# Altium schematic sheet Box.SchDoc
size A
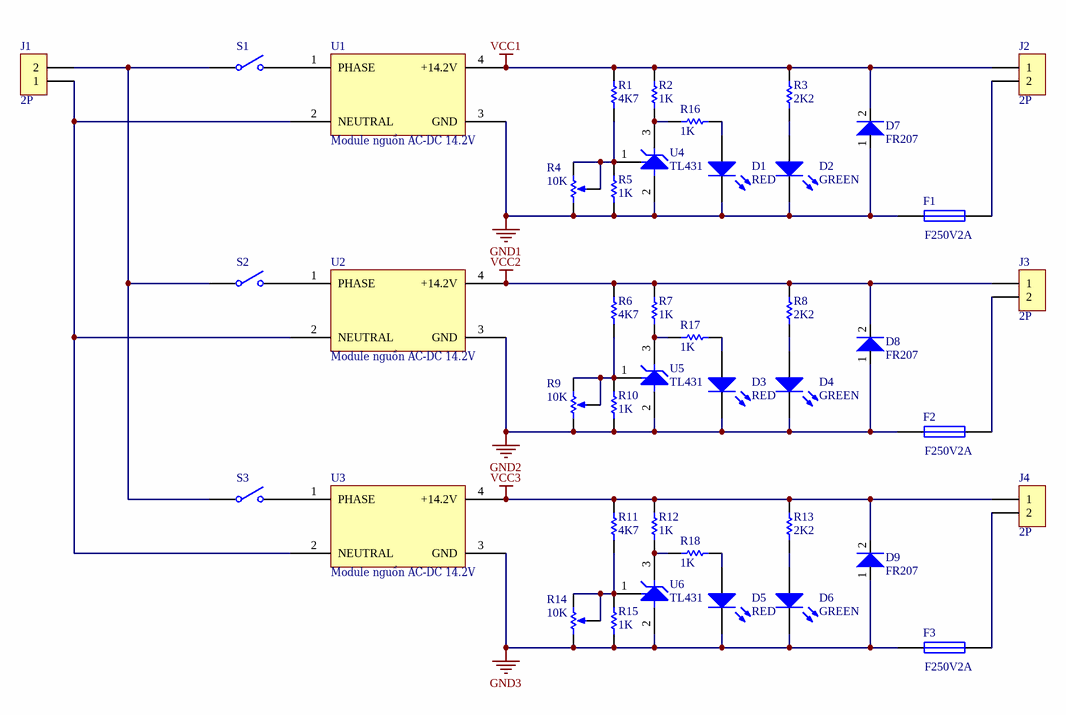
[diagram p0: Box.SchDoc]

## Parts
D1  value RED  [LED-0]
D2  value GREEN  [LED-0]
D3  value RED  [LED-0]
D4  value GREEN  [LED-0]
D5  value RED  [LED-0]
D6  value GREEN  [LED-0]
D7  value FR207  [DIODE1A]
D8  value FR207  [DIODE1A]
D9  value FR207  [DIODE1A]
F1  value F250V2A  [FUSE2]
F2  value F250V2A  [FUSE2]
F3  value F250V2A  [FUSE2]
J1  value 2P  [JACK2]  (hidden comment: Giắc xanh loại đứng, 300V/16A - 5.08mm 2P)
J2  value 2P  [JACK2]  (hidden comment: Giắc xanh loại đứng, 300V/16A - 5.08mm 2P)
J3  value 2P  [JACK2]  (hidden comment: Giắc xanh loại đứng, 300V/16A - 5.08mm 2P)
J4  value 2P  [JACK2]  (hidden comment: Giắc xanh loại đứng, 300V/16A - 5.08mm 2P)
R1  value 4K7  [0805DD]
R2  value 1K  [0805DD]
R3  value 2K2  [0805DD]
R4  value 10K  [BTXANH]
R5  value 1K  [0805DD]
R6  value 4K7  [0805DD]
R7  value 1K  [0805DD]
R8  value 2K2  [0805DD]
R9  value 10K  [BTXANH]
R10  value 1K  [0805DD]
R11  value 4K7  [0805DD]
R12  value 1K  [0805DD]
R13  value 2K2  [0805DD]
R14  value 10K  [BTXANH]
R15  value 1K  [0805DD]
R16  value 1K  [0805DD]
R17  value 1K  [0805DD]
R18  value 1K  [0805DD]
S1  Giắc cắm loại đứng, 300V/16A - 5.08mm 2P  [JACK2]  (value not drawn)
S2  Giắc cắm loại đứng, 300V/16A - 5.08mm 2P  [JACK2]  (value not drawn)
S3  Giắc cắm loại đứng, 300V/16A - 5.08mm 2P  [JACK2]  (value not drawn)
U1  Module nguồn AC-DC 14.2V  [PS15V2A]
U2  Module nguồn AC-DC 14.2V  [PS15V2A]
U3  Module nguồn AC-DC 14.2V  [PS15V2A]
U4  value TL431  [TO92_431]
U5  value TL431  [TO92_431]
U6  value TL431  [TO92_431]

## Nets
GND1: D1.2(K) D2.2(K) D7.1(A) F1.1 R4.1(TOP) R5.1 U1.3(GND) U4.2(A)
GND2: D3.2(K) D4.2(K) D8.1(A) F2.1 R9.1(TOP) R10.1 U2.3(GND) U5.2(A)
GND3: D5.2(K) D6.2(K) D9.1(A) F3.1 R14.1(TOP) R15.1 U3.3(GND) U6.2(A)
VCC1: D7.2(K) J2.1 R1.1 R2.2 R3.2 U1.4(+14.2V)
VCC2: D8.2(K) J3.1 R6.1 R7.2 R8.2 U2.4(+14.2V)
VCC3: D9.2(K) J4.1 R11.1 R12.2 R13.2 U3.4(+14.2V)
NetD1_1: D1.1(A) R16.1
NetD2_1: D2.1(A) R3.1
NetD3_1: D3.1(A) R17.1
NetD4_1: D4.1(A) R8.1
NetD5_1: D5.1(A) R18.1
NetD6_1: D6.1(A) R13.1
NetF1_2: F1.2 J2.2
NetF2_2: F2.2 J3.2
NetF3_2: F3.2 J4.2
NetJ1_1: J1.1 U1.2(NEUTRAL) U2.2(NEUTRAL) U3.2(NEUTRAL)
NetJ1_2: J1.2 S1.1(COMMON) S2.1(COMMON) S3.1(COMMON)
NetR1_2: R1.2 R4.2(TAP) R4.3(BOT) R5.2 U4.1(R)
NetR2_1: R2.1 R16.2 U4.3(K)
NetR6_2: R6.2 R9.2(TAP) R9.3(BOT) R10.2 U5.1(R)
NetR7_1: R7.1 R17.2 U5.3(K)
NetR11_2: R11.2 R14.2(TAP) R14.3(BOT) R15.2 U6.1(R)
NetR12_1: R12.1 R18.2 U6.3(K)
NetS1_2: S1.2(NO) U1.1(PHASE)
NetS2_2: S2.2(NO) U2.1(PHASE)
NetS3_2: S3.2(NO) U3.1(PHASE)

## Library data of the parts
D1-D6 = LED0: Typical INFRARED GaAs LED; Type1: LED dán 0805; Type2: LED chân cắm 3mm; Type3: LED chân cắm 5mm; Published: *; LatestRevisionDate: *; LatestRevisionNote: *; PackageReference: *; Publisher: *
D7-D9 = DIODE: Type1: Diode xung chân cắm 3A; Type2: Diode chỉnh lưu chân cắm 1A; Type3: Diode chỉnh lưu chân cắm 3A; Type4: Diode xung chân cắm 2A
F1-F3 = Fuse 1: Fuse; Type1: Cầu chì và đế cầu chì; Published: 8-Jun-2000; LatestRevisionDate: 17-Jul-2002; LatestRevisionNote: Re-released for DXP Platform.; PackageReference: PIN-W2/E2.8; Publisher: Altium Limited; PackageDescription: Thru-Hole; 2 Leads
J1-J4 = CON2: Type1: Giắc xanh loại nằm, 300V/16A - 5.08mm; Type2: Jump đực loại thẳng, 2.54mm; Type3: Jumper; Type4: Giắc xanh loại nằm, 300V/16A - 3.81mm
R1-R3 R5-R8 R10-R13 R15-R18 = Res Semi: Semiconductor Resistor; Type1: Điện trở dán 0805; Type2: Điện trở chân cắm 1/4W; Type3: Điện trở chân cắm 2W; Published: *; LatestRevisionDate: *; LatestRevisionNote: *; PackageReference: *; Publisher: *
R4 R9 R14 = RPot: Potentiometer; Type1: Biến trở vi chỉnh TRIMMER 3296; Published: *; LatestRevisionDate: *; LatestRevisionNote: *; PackageReference: *; Publisher: *; Sim Note: *; Set Position: *
S1-S3 = SW-SPST: Single-Pole, Single-Throw Switch; Published: 24-Mar-1999; LatestRevisionDate: 17-Jul-2002; LatestRevisionNote: Re-released for DXP Platform.; PackageReference: SPST-2; Publisher: Altium Limited; PackageDescription: Switch; 2 Leads
U1-U3 = SACACQUY
U4-U6 = TL431: Adjustable Precision Shunt Regulator; Type1: IC điện áp chuẩn, chân cắm TO92